# EAGLE design ASD2303 (EAGLE 6.3)
DATABASE: ./../../../../../Components/TinyCircuits_Part_Database.txt
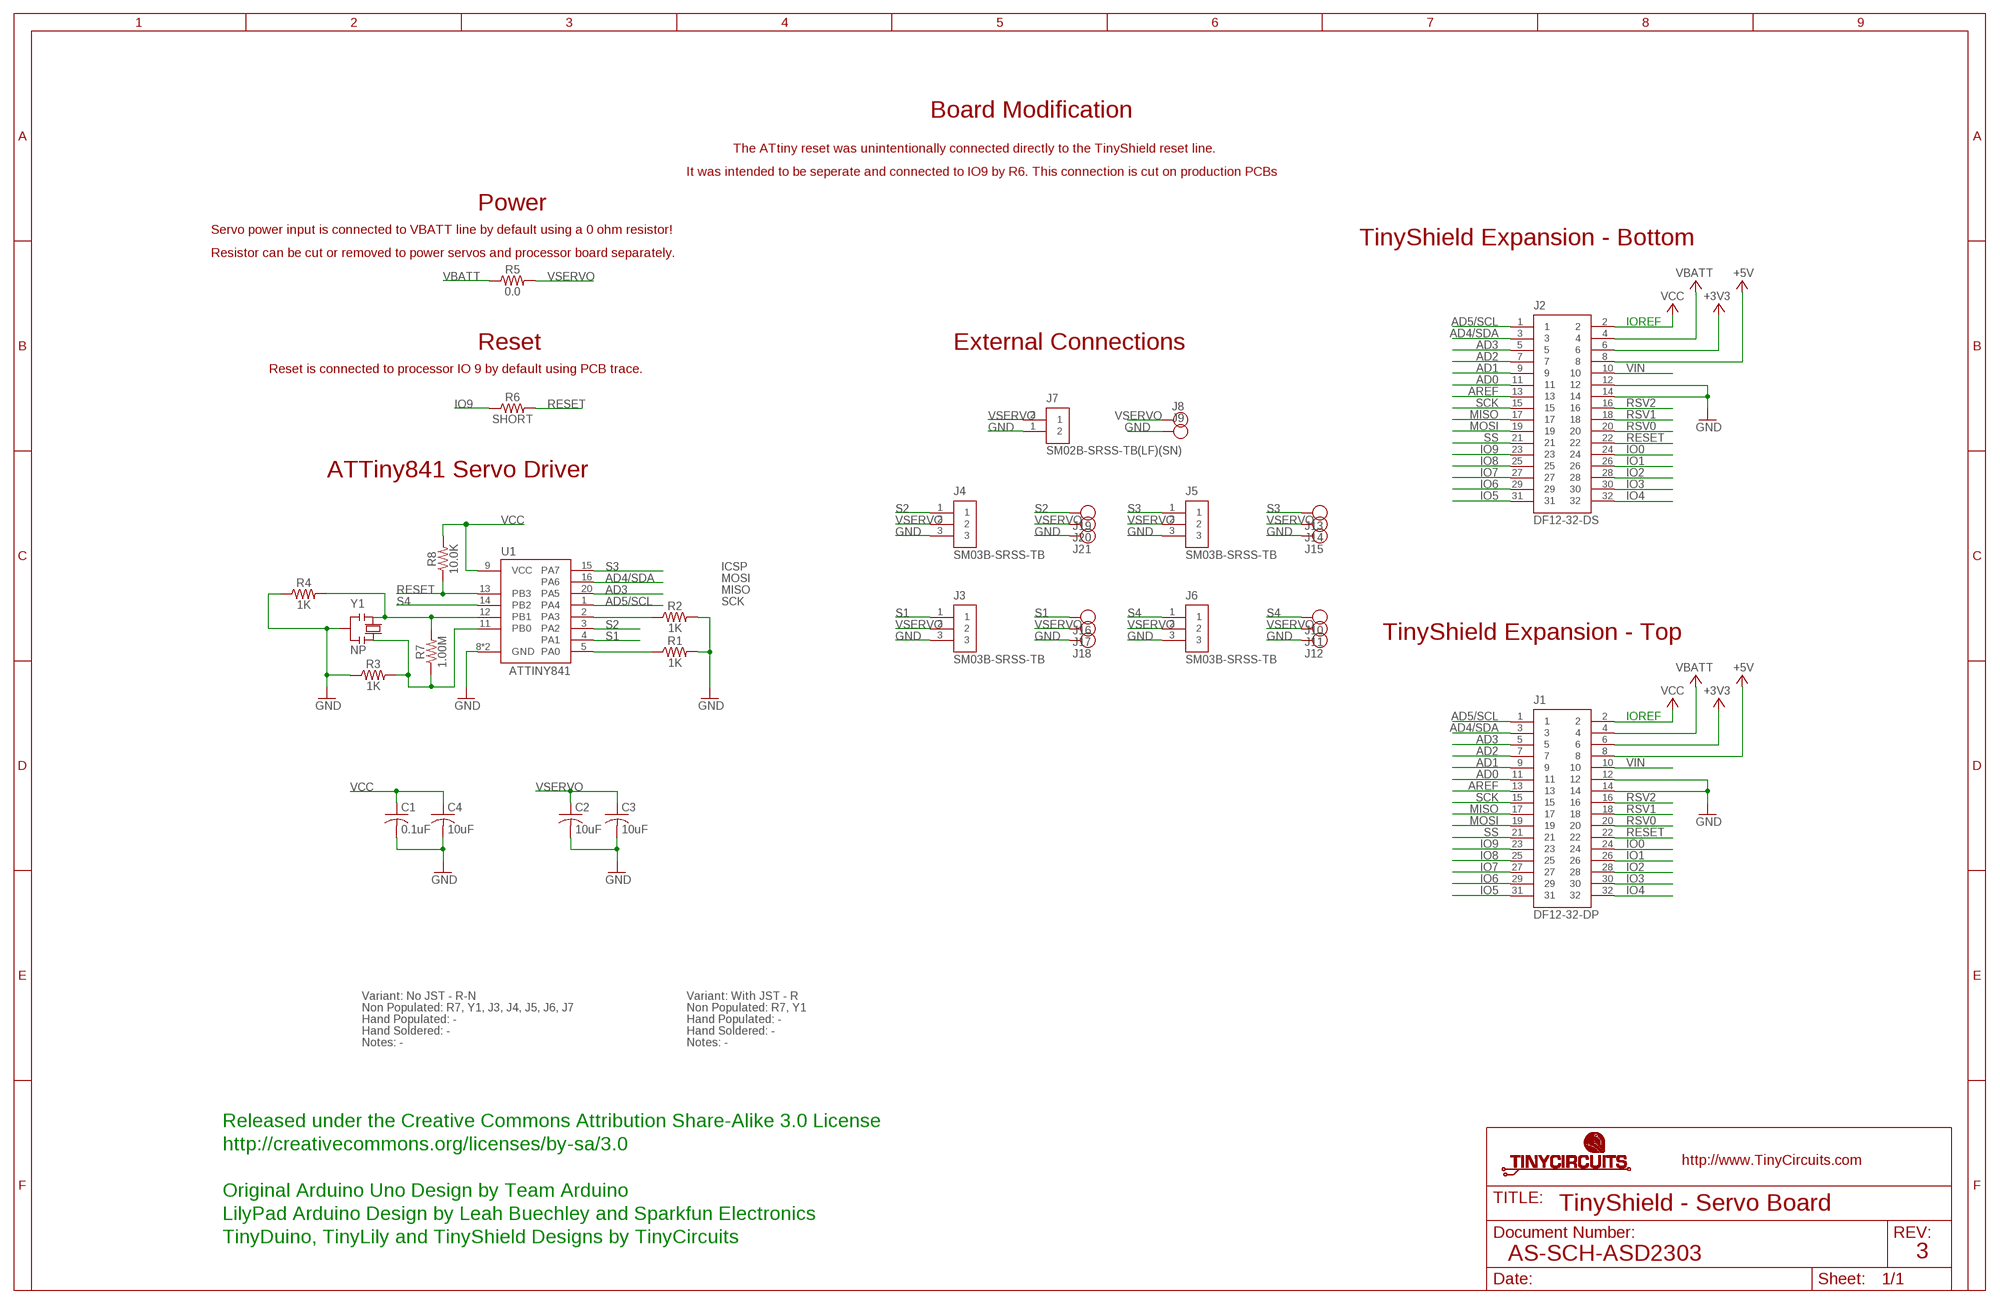
[diagram p0: schematic, sheet 1]

## Parts
C1  0.1uF  AS-ITM-00008  [C0402]
C2  10uF  AS-ITM-00045  [C0805]
C3  10uF  AS-ITM-00045  [C0805]
C4  10uF  AS-ITM-00045  [C0805]
J1  DF12-32-DP  AS-ITM-00015  [DF12-32-DP]
J2  DF12-32-DS  AS-ITM-00012  [DF12-32-DS]
J3  SM03B-SRSS-TB  AS-ITM-00244  [JST_SH_3X1]
J4  SM03B-SRSS-TB  AS-ITM-00244  [JST_SH_3X1]
J5  SM03B-SRSS-TB  AS-ITM-00244  [JST_SH_3X1]
J6  SM03B-SRSS-TB  AS-ITM-00244  [JST_SH_3X1]
J7  SM02B-SRSS-TB(LF)(SN)  AS-ITM-00231  [JST_SH_2X1]
J8  PIN_1X.1"1  [1X.1"_2]
J9  PIN_1X.1"1  [1X.1"_2]
J10  PIN_1X.1"1  [1X.1"_2]
J11  PIN_1X.1"1  [1X.1"_2]
J12  PIN_1X.1"1  [1X.1"_2]
J13  PIN_1X.1"1  [1X.1"_2]
J14  PIN_1X.1"1  [1X.1"_2]
J15  PIN_1X.1"1  [1X.1"_2]
J16  PIN_1X.1"1  [1X.1"_2]
J17  PIN_1X.1"1  [1X.1"_2]
J18  PIN_1X.1"1  [1X.1"_2]
J19  PIN_1X.1"1  [1X.1"_2]
J20  PIN_1X.1"1  [1X.1"_2]
J21  PIN_1X.1"1  [1X.1"_2]
R1  1K  AS-ITM-00003  [0402]
R2  1K  AS-ITM-00003  [0402]
R3  1K  AS-ITM-00003  [0402]
R4  1K  AS-ITM-00003  [0402]
R5  0.0  AS-ITM-00076  [0402]
R6  SHORT  AS-ITM-000760402_SHORT  [0402_SHORT]
R7  1.00M  AS-ITM-00005  [0402]
R8  10.0K  AS-ITM-00032  [0402]
U1  ATTINY841  AS-ITM-00255  [VQFN-20]
Y1  NP  AS-ITM-00027B  [RESONATOR_SMALL]

## Nets
+3V3: J1.6 J2.6
+5V: J1.8 J2.8
AD0: J1.11 J2.11
AD1: J1.9 J2.9
AD2: J1.7 J2.7
AD3: J1.5 J2.5 U1.20(PA5)
AD4/SDA: J1.3 J2.3 U1.16(PA6)
AD5/SCL: J1.1 J2.1 U1.1(PA4)
AREF: J1.13 J2.13
GND: C1.2 C2.2 C3.2 C4.2 J1.12 J1.14 J2.12 J2.14 J3.3 J4.3 J5.3 J6.3 J7.1 J9.1 J12.1 J15.1 J18.1 J21.1 R1.2 R2.2 R3.1 R4.1 U1.8(GND) U1.PAD(GND) Y1.2
IO0: J1.24 J2.24
IO1: J1.26 J2.26
IO2: J1.28 J2.28
IO3: J1.30 J2.30
IO4: J1.32 J2.32
IO5: J1.31 J2.31
IO6: J1.29 J2.29
IO7: J1.27 J2.27
IO8: J1.25 J2.25
IO9: J1.23 J2.23 R6.1
MISO: J1.17 J2.17
MOSI: J1.19 J2.19
N$1: R4.2 R7.2 U1.12(PB1) Y1.1
N$2: R3.2 R7.1 U1.11(PB0) Y1.3
N$3: R2.1 U1.2(PA3)
N$4: R1.1 U1.5(PA0)
RESET: J1.22 J2.22 R6.2 R8.1 U1.13(PB3)
RSV0: J1.20 J2.20
RSV1: J1.18 J2.18
RSV2: J1.16 J2.16
S1: J3.1 J16.1 U1.4(PA1)
S2: J4.1 J19.1 U1.3(PA2)
S3: J5.1 J13.1 U1.15(PA7)
S4: J6.1 J10.1 U1.14(PB2)
SCK: J1.15 J2.15
SS: J1.21 J2.21
VBATT: J1.4 J2.4 R5.1
VCC: C1.1 C4.1 J1.2 J2.2 R8.2 U1.9(VCC)
VIN: J1.10 J2.10
VSERVO: C2.1 C3.1 J3.2 J4.2 J5.2 J6.2 J7.2 J8.1 J11.1 J14.1 J17.1 J20.1 R5.2

## Notes on the sheet
- Board Modification
- The ATtiny reset was unintentionally connected directly to the TinyShield reset line.
- It was intended to be seperate and connected to IO9 by R6. This connection is cut on production PCBs
- Power
- Servo power input is connected to VBATT line by default using a 0 ohm resistor!
- TinyShield Expansion - Bottom
- Resistor can be cut or removed to power servos and processor board separately.
- IOREF
- Reset | External Connections
- Reset is connected to processor IO 9 by default using PCB trace.
- ATTiny841 Servo Driver
- ICSP
- MOSI
- MISO
- SCK
- TinyShield Expansion - Top
- IOREF
- Variant: No JST - R-N | Variant: With JST - R
- Non Populated: R7, Y1, J3, J4, J5, J6, J7 | Non Populated: R7, Y1
- Hand Populated: - | Hand Populated: -
- Hand Soldered: - | Hand Soldered: -
- Notes: - | Notes: -
- Released under the Creative Commons Attribution Share-Alike 3.0 License
- http://creativecommons.org/licenses/by-sa/3.0
- Original Arduino Uno Design by Team Arduino
- TinyShield - Servo Board
- LilyPad Arduino Design by Leah Buechley and Sparkfun Electronics
- TinyDuino, TinyLily and TinyShield Designs by TinyCircuits
- AS-SCH-ASD2303 | 3

## Library data of the parts
C1 = tinycircuits:AS-ITM-00008: CAP CER 0.1UF 16V 10% X5R 0402; PARTNO: AS-ITM-00008
C2-C4 = tinycircuits:AS-ITM-00045: CAP CER 16UF 16V 20% X5R 0805; PARTNO: AS-ITM-00045
J1 = tinycircuits:AS-ITM-00015: CONN HEADER 32POS 3MM SMD 0.5MM; PARTNO: AS-ITM-00015
J2 = tinycircuits:AS-ITM-00012: CONN RECEPT 32POS 3MM SMD 0.5MM; PARTNO: AS-ITM-00012
J3-J6 = tinycircuits:AS-ITM-00244: CONN HEADER SH 3POS SIDE 1MM TIN; PARTNO: AS-ITM-00244; PNPROTATION: 180
J7 = tinycircuits:AS-ITM-00231: CONN HEADER SH 2POS SIDE 1MM; PARTNO: AS-ITM-00231; PNPROTATION: 180
J8-J21 = tinycircuits:PIN_1X.1": 1 Pin 0.100" Header
R1-R4 = tinycircuits:AS-ITM-00003: RES 1.00K OHM 1/16W 1% 0402; PARTNO: AS-ITM-00003; VALUE: 1.00K
R5 = tinycircuits:AS-ITM-00076: RES 0.0 OHM 1/16W 1% 0402 SMD; PARTNO: AS-ITM-00076
R6 = tinycircuits:AS-ITM-00076: RES 0.0 OHM 1/16W 1% 0402 SMD
R7 = tinycircuits:AS-ITM-00005: RES 1.00M OHM 1/16W 1% 0402; PARTNO: AS-ITM-00005
R8 = tinycircuits:AS-ITM-00032: RES 10.0K OHM 1/16W 1% 0402 SMD; PARTNO: AS-ITM-00032
U1 = tinycircuits:AS-ITM-00255: IC MCU 8BIT 8KB FLASH 20VQFN; PARTNO: AS-ITM-00255
Y1 = tinycircuits:AS-ITM-00027: CER RESONATOR 8.00MHZ SMD; PARTNO: AS-ITM-00027; VALUE: 8.00MHZ

## Board
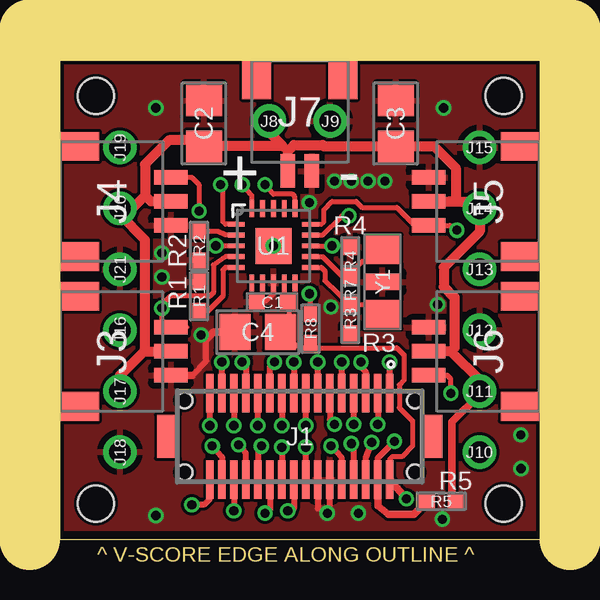
[diagram p1: board, top side]
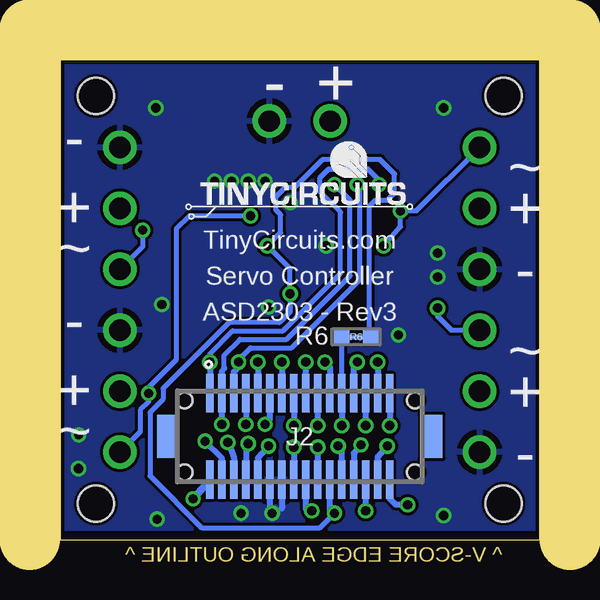
[diagram p2: board, bottom side, seen from below]

Size 20 x 20 mm. Coordinates in mm from the lower left corner, seen from the top.
Outline: 0,20 20,20 20,0 0,0 0,20
Copper layers (1*16): Top 0.035mm / dielectric 1.5mm / Bottom 0.035mm
Design rules "default *": minimum track width 5mil, minimum drill 15mil, track to track 5mil, track to pad 5mil, pad to pad 5mil, via to via 6mil, smd to smd 5mil, copper to edge 6mil, drill to drill 8mil, minimum pad ring 10mil, minimum via ring 5mil, stop-mask expansion 4mil, vias tented up to drill 25mil, thermal gap 10mil
Holes 1.5 mm at 1.5,18.5 18.5,18.5 18.5,1.5 1.5,1.5
tRestrict: 5 lines
bRestrict: 1 lines
Milling: 3 lines

### Footprints (pad centres in the part's own frame; a part is rotated, then mirrored left to right if it is on the bottom)
C0402 = smd 0.65 x 0.6: 1 -0.65,0; 2 0.65,0
C0805 = smd 1.3 x 1.5: 1 -0.95,0; 2 0.95,0
DF12-32-DP = smd 0.3 x 1.6: 1 -3.75,-1.8; 2 -3.75,1.8; 3 -3.25,-1.8; 4 -3.25,1.8; 5 -2.75,-1.8; 6 -2.75,1.8; 7 -2.25,-1.8; 8 -2.25,1.8; 9 -1.75,-1.8; 10 -1.75,1.8; 11 -1.25,-1.8; 12 -1.25,1.8; 13 -0.75,-1.8; 14 -0.75,1.8; 15 -0.25,-1.8; 16 -0.25,1.8; 17 0.25,-1.8; 18 0.25,1.8; 19 0.75,-1.8; 20 0.75,1.8; 21 1.25,-1.8; 22 1.25,1.8; 23 1.75,-1.8; 24 1.75,1.8; 25 2.25,-1.8; 26 2.25,1.8; 27 2.75,-1.8; 28 2.75,1.8; 29 3.25,-1.8; 30 3.25,1.8; 31 3.75,-1.8; 32 3.75,1.8 | smd 0.9 x 1.8: F1 -5.5,0; F2 5.5,0 | hole 0.65: -4.8,1.5; 4.8,1.5
DF12-32-DS = smd 0.3 x 1.6: 1 -3.75,1.8; 2 -3.75,-1.8; 3 -3.25,1.8; 4 -3.25,-1.8; 5 -2.75,1.8; 6 -2.75,-1.8; 7 -2.25,1.8; 8 -2.25,-1.8; 9 -1.75,1.8; 10 -1.75,-1.8; 11 -1.25,1.8; 12 -1.25,-1.8; 13 -0.75,1.8; 14 -0.75,-1.8; 15 -0.25,1.8; 16 -0.25,-1.8; 17 0.25,1.8; 18 0.25,-1.8; 19 0.75,1.8; 20 0.75,-1.8; 21 1.25,1.8; 22 1.25,-1.8; 23 1.75,1.8; 24 1.75,-1.8; 25 2.25,1.8; 26 2.25,-1.8; 27 2.75,1.8; 28 2.75,-1.8; 29 3.25,1.8; 30 3.25,-1.8; 31 3.75,1.8; 32 3.75,-1.8 | smd 0.9 x 1.8: F1 -5.5,0; F2 5.5,0 | hole 0.65: -4.8,1.5; 4.8,1.5
JST_SH_3X1 = smd 0.6 x 1.4: 1 -1,2.475; 2 0,2.475; 3 1,2.475 | smd 1.2 x 1.6: PAD1 -2.3,-1.325; PAD2 2.3,-1.325
JST_SH_2X1 = smd 0.6 x 1.4: 1 -0.5,2.475; 2 0.5,2.475 | smd 1.2 x 1.6: PAD1 -1.8,-1.325; PAD2 1.8,-1.325
1X.1"_2 = drill 0.889 pad 1.397: 1 0,0
0402 = smd 0.65 x 0.55: 1 -0.6,0; 2 0.6,0
0402_SHORT = smd 0.65 x 0.55: 1 -0.6,0; 2 0.6,0
VQFN-20 = smd 0.7 x 0.2: 1 -1.55,0.9; 2 -1.55,0.45; 3 -1.55,0; 4 -1.55,-0.45; 5 -1.55,-0.9; 11 1.55,-0.9; 12 1.55,-0.45; 13 1.55,0; 14 1.55,0.45; 15 1.55,0.9 | smd 0.2 x 0.7: 6 -0.9,-1.55; 7 -0.45,-1.55; 8 0,-1.55; 9 0.45,-1.55; 10 0.9,-1.55; 16 0.9,1.55; 17 0.45,1.55; 18 0,1.55; 19 -0.45,1.55; 20 -0.9,1.55 | smd 1.5 x 1.5: PAD 0,0
RESONATOR_SMALL = smd 1.2 x 1.5: 1 -1.35,0; 3 1.35,0 | smd 0.7 x 1.5: 2 0,0

### Placement (x,y rotation side)
C1  8.85,9.9 180 top
C2  6,17.35 90 top
C3  14,17.35 90 top
C4  8.25,8.65 180 top
J1  10,4.3 180 top
J2  10,4.3 0 bottom
J3  2.15,7.85 270 top
J4  2.15,14.1 270 top
J5  17.85,14.1 90 top
J6  17.85,7.85 90 top
J7  10,17.85 180 top
J8  8.73,17.45 0 top
J9  11.27,17.45 0 top
J10  17.5,3.65 180 top
J11  17.5,6.19 180 top
J12  17.5,8.73 180 top
J13  17.5,11.27 180 top
J14  17.5,13.81 180 top
J15  17.5,16.35 180 top
J16  2.5,8.73 270 top
J17  2.5,6.19 270 top
J18  2.5,3.65 270 top
J19  2.5,16.35 270 top
J20  2.5,13.81 270 top
J21  2.5,11.27 270 top
R1  5.8,10.15 90 top
R2  5.8,12.25 270 top
R3  12.1,9.2 90 top
R4  12.1,11.6 270 top
R5  15.9,1.6 0 top
R6  7.65,8.45 0 bottom
R7  12.1,10.4 90 top
R8  10.45,8.8 270 top
U1  8.9,12.25 0 top
U$1  [DOCFIELD-TINYCIRCUITS-PCB]  33.91,-10 0 top  (outside the outline)
Y1  13.45,10.75 270 top

### Tracks (layer width: path | path; a pad name or v marks a point on that pad's centre or on a via)
+3V3  (via drill 0.38)
  Top 0.254: J2.6 12.75,3.4 v13,4.05
  Bottom 0.254: v13,4.05 12.75,3.4 J2.6
+5V  (via drill 0.38)
  Top 0.254: J2.8 12.25,3.8 v12.15,4
  Bottom 0.254: v12.15,4 12.25,3.8 J2.8
AD0  (via drill 0.38)
  Top 0.254: J2.11 11.25,5 v11.45,4.8
  Bottom 0.254: v11.45,4.8 11.25,5 J2.11
AD1  (via drill 0.38)
  Top 0.254: J2.9 v11.75,7.4
  Bottom 0.254: v11.75,7.4 J2.9
AD2  (via drill 0.38)
  Top 0.254: v12.25,4.8 J2.7
  Bottom 0.254: J2.7 v12.25,4.8
AD3  (via drill 0.38)
  Top 0.203: U1.20 8,14.35 v7.6,14.8
  Top 0.254: v12.55,7.4 12.55,7.2 12.75,7 J2.5
  Bottom 0.203: 12.6,7.45 12.05,8 10.35,8 7.5,10.85 7.5,14.7 v7.6,14.8
  Bottom 0.254: J2.5 12.75,7 12.55,7.2 v12.55,7.4 12.6,7.45
AD4/SDA  (via drill 0.38)
  Top 0.203: U1.16 9.8,14.3 9.7,14.4 8.9,14.4 v8.55,14.8
  Top 0.254: J2.3 v13.25,4.8
  Bottom 0.203: 13.15,7.15 13.15,7.7 12.5,8.35 10.55,8.35 7.9,11 7.9,14.15 v8.55,14.8 8.35,14.6
  Bottom 0.254: v13.25,4.8 J2.3 13.25,7 13.15,7.15
AD5/SCL  (via drill 0.38)
  Top 0.203: U1.1 6.9,13.15 6.8,13.25 6.8,14.7 v6.7,14.8
  Top 0.254: J2.1 v13.75,7.4
  Bottom 0.203: v13.75,7.4 13.75,7.75 12.8,8.7 10.7,8.7 8.3,11.1 8.3,13.65 9.15,14.5 9.15,15.1 8.8,15.45 7.15,15.45 6.7,15 v6.7,14.8
  Bottom 0.254: v13.75,7.4 J2.1
AREF  (via drill 0.38)
  Top 0.254: J2.13 v10.75,7.4
  Bottom 0.254: v10.75,7.4 J2.13
GND  (via drill 0.38)
  Top 0.203: 10.75,1.3 v11.15,1.1 11.25,1.3 | U1.8 8.9,10.25 8.6,9.95 C1.2
  Top 0.254: J2.14 10.75,1.3 | 11.25,1.3 J2.12 | 5.5,6.85 6.1,7.45 6.1,8.35
  Top 0.305: J3.3 5.5,6.85 | 6.1,8.35 6.4,8.65 C4.2
  Bottom 0.203: 10.75,1.3 v11.15,1.1 11.25,1.3
  Bottom 0.254: J2.14 10.75,1.3 | 11.25,1.3 J2.12
  other vias: 15.95,0.85 4,1 4,18 16,18 15.75,9.8 19.23,2.96 19.22,4.37 11.45,14.95 5.88,8.53 4.25,11.95 4.25,10.95 12.15,14.95 12.85,14.95 13.55,14.95 8.9,12.25 11.3,9.7 12.45,1.1 10.4,14.05
  pour Top: 0,20 20,20 20,0 0,0
  pour Bottom: 0,20 20,20 20,0 0,0
IO0  (via drill 0.38)
  Top 0.254: v8.4,3.9 8.25,3.85 J2.24
  Bottom 0.254: J2.24 8.25,3.85 v8.4,3.9
IO1  (via drill 0.38)
  Top 0.254: J2.26 7.75,3.6 v7.45,3.95
  Bottom 0.254: v7.45,3.95 7.75,3.6 J2.26
IO2  (via drill 0.38)
  Top 0.254: J2.28 | J2.28 v7.25,1.2
  Bottom 0.254: v7.25,1.2 J2.28 | J2.28
IO3  (via drill 0.38)
  Top 0.254: v6.35,3.9 6.75,3.45 J2.30
  Bottom 0.254: J2.30 6.75,3.45 v6.35,3.9
IO4  (via drill 0.38)
  Top 0.254: v5.5,1.45 6,1.45 6.25,1.7 J2.32 6.25,2.55
  Bottom 0.254: v5.5,1.45 6,1.45 6.25,1.7 J2.32
IO5  (via drill 0.38)
  Top 0.254: v6.25,4.75 J2.31
  Bottom 0.254: J2.31 v6.25,4.75
IO6  (via drill 0.38)
  Top 0.254: J2.29 v6.75,7.4
  Bottom 0.254: v6.75,7.4 J2.29
IO7  (via drill 0.38)
  Top 0.254: J2.27 v7.25,4.75
  Bottom 0.254: v7.25,4.75 J2.27
IO8  (via drill 0.38)
  Top 0.254: v7.6,7.4 7.75,7.25 J2.25
  Bottom 0.254: J2.25 7.75,7.25 v7.6,7.4
IO9  (via drill 0.38)
  Top 0.254: v8.25,4.75 J2.23
  Bottom 0.203: J2.23 R6.1
  Bottom 0.254: J2.23 v8.25,4.75
MISO  (via drill 0.38)
  Top 0.254: v9.75,7.4 J2.17
  Bottom 0.254: J2.17 v9.75,7.4
MOSI  (via drill 0.38)
  Top 0.254: J2.19 v9.25,4.75
  Bottom 0.254: v9.25,4.75 J2.19
N$1
  Top 0.203: Y1.1 12.9,11.6 12.6,11.6 12.05,11.05 R4.2 11.75,11 10.95,11.8 U1.12
N$2
  Top 0.203: U1.11 10.9,11.35 11.05,11.2 11.05,10.8 R3.2 13,9.8 Y1.3
N$3
  Top 0.203: U1.2 6.9,12.7 6.6,12.85 R2.1
N$4
  Top 0.203: U1.5 6.9,11.35 6.8,11.25 6.8,10.15 6.2,9.55 R1.1
RESET  (via drill 0.38)
  Top 0.203: U1.13 v11.35,12.25 | R8.1 10.45,10.15 v10.4,10.25 10.45,10.2 R8.1
  Top 0.254: J2.22 8.75,1.25 v8.55,1.1
  Bottom 0.203: v8.55,1.1 9.15,0.5 14.1,0.5 16.25,2.65 16.25,5.3 15.7,5.85 15.7,6.3 12.95,9.05 10.85,9.05 10.4,9.5 v10.4,10.25 10.4,11.3 v11.35,12.25 10.8,12.8 10.8,13.55 11,13.75 11,14.3 10.6,14.7 10.2,14.7 9.05,15.85 6.65,15.85 6.05,15.25 6.05,14.45 6.35,14.15 6.85,14.15 7.1,13.9 7.1,8.6 R6.2
  Bottom 0.254: v8.55,1.1 8.75,1.25 J2.22
RSV0  (via drill 0.38)
  Top 0.254: v9.25,3.85 J2.20
  Bottom 0.254: J2.20 v9.25,3.85
RSV1  (via drill 0.38)
  Top 0.254: J2.18 9.75,1.3 v9.5,1.2
  Bottom 0.254: v9.5,1.2 9.75,1.3 J2.18
RSV2  (via drill 0.38)
  Top 0.254: J2.16 v10.25,3.85
  Bottom 0.254: v10.25,3.85 J2.16
S1  (via drill 0.38)
  Top 0.203: U1.4 6.9,11.8 6.4,11.45 6.4,10.3 6.25,10.15 4.6,10.15 4.25,9.8 v4.25,9.65 4.25,9 4.38,8.88 4.65,8.88 J3.1 5.3,8.85
  Bottom 0.203: v4.25,9.65 4.25,9.3 3.68,8.73 J16.1
S2  (via drill 0.38)
  Top 0.203: J4.1 5.5,15.1 5.8,14.8 v5.8,13.7 | U1.3 v6.5,12.25
  Bottom 0.203: J19.1 5.15,13.7 v5.8,13.7 5.8,13.05 v6.5,12.25
S3  (via drill 0.38)
  Top 0.203: U1.15 10.9,13.15 11,13.25 11,13.75 11.35,14.1 12.35,14.1 12.6,13.85 14.05,13.85 14.8,13.1 J5.1 16.25,13.1 16.45,12.9 v16.55,12.9
  Bottom 0.203: J13.1 16.55,12.22 v16.55,12.9
S4  (via drill 0.38)
  Top 0.203: U1.14 10.95,12.7 11.75,13.5 v12.05,13.5 | v16.3,6.1 16.3,6.7 16.15,6.85 J6.1
  Bottom 0.203: J10.1 16.65,4.5 16.65,5.4 16.3,5.75 v16.3,6.1 16.3,6.35 15.15,7.5 15.15,12.95 14.6,13.5 v12.05,13.5
SCK  (via drill 0.38)
  Top 0.254: v10.25,4.75 J2.15
  Bottom 0.254: J2.15 v10.25,4.75
SS  (via drill 0.38)
  Top 0.254: J2.21 8.75,7.2 v8.95,7.4
  Bottom 0.254: v8.95,7.4 8.75,7.2 J2.21
VBATT  (via drill 0.38)
  Top 0.254: J1.4 13.25,3.4 v13.95,4.1
  Top 0.305: J1.4 13.25,1.4 13.7,1.05 14.75,1.05 R5.1
  Bottom 0.254: J1.4 13.25,3.4 v13.95,4.1
VCC  (via drill 0.38)
  Top 0.203: 13.75,2.9 J2.2 13.75,3.35 13.85,3.45 14.25,3.45 14.7,3.9 14.7,4.95 14.15,5.5 14.15,6.45 14.35,6.65 14.35,7.7 14.05,8 10.45,8 | U1.9 9.35,10.2 C1.1 9.6,8.9 C4.1 10,8 10.45,8 | R8.2 10.45,8
  Top 0.305: J2.2 v14.45,1.7
  Bottom 0.305: v14.45,1.7 J2.2
VIN  (via drill 0.38)
  Top 0.254: J2.10 11.75,3.4 v11.3,3.9
  Bottom 0.254: v11.3,3.9 11.75,3.4 J2.10
VSERVO
  Top 0.305: 16.5,14.15 16.25,14.1 | 9.5,16.2 9.3,16.4 | J11.1 17.5,6.05 16.35,4.9 16.35,1.75 R5.2 | 3.5,7.85 3.55,8
  Top 0.406: 16.5,14.15 16.5,15.5 15.6,16.4 C3.1 11,16.4 10.95,16.45 9.75,16.45 9.5,16.2 J7.2 | J5.2 16.25,14.1 17.21,14.1 J14.1 17.5,12.85 16,11.35 16,10.55 16.45,10.1 16.45,8 16.3,7.85 | 3.55,14.35 3.55,15.65 4.55,16.65 5.5,16.65 C2.1 9.3,16.4 8.73,16.97 J8.1 | 3.55,14.35 3.8,14.1 J4.2 | J3.2 3.5,7.85 2.5,6.85 J17.1 | 16.3,7.85 J6.2 | 16.3,7.85 17.5,6.65 J11.1 | 3.55,8 3.55,12.5 2.5,13.55 J20.1 3.01,13.81 3.55,14.35

### Text on the board
Dimension: ^ V-SCORE EDGE ALONG OUTLINE ^
tPlace: + | - | R4 | R2 | R1 | R3 | R5
bPlace: + | - | ~ | - | + | + | TinyCircuits.com | ~ | - | Servo Controller | ASD2303 - Rev3 | - | ~ | R6 | + | + | - | ~
Document: FABRICATION DRAWING | NOTES: | 1. PRINTED CIRCUIT BOARD MADE FROM NEMA GRADE FR-4 EPOXY LAMINATE | WITH 1 OUNCE COPPER PLATING AND .024 THICKNESS. | 2. ALL DIMENSIONS ARE GIVEN IN INCHES. | 3. CIRCUIT PATHS ARE FOR REFERENCE ONLY. | 4. HOLE SIZES SHOWN ARE FINISHED DIAMETERS AFTER PLATING. | 5. BOARD PLATED USING REFLOW OR SIMILAR METHOD. | 6. BOARD TO HAVE BLUE SOLDER MASK ON PLATED SURFACES USING WET FILM | 7. SILKSCREEN BOARD USING WHITE INK. | SR100 OR SR1010 EPOXY. EQUIVALENT WET OR DRY FILM MAY BE USED. | 8. THE FOLLOWING INFORMATION APPLIES TO THIS BOARD: | * 2 COPPER LAYERS | * .024 BOARD THICKNESS | * REQUIRES TOP SIDE SILKSCREEN | Released under the Creative Commons Attribution Share-Alike 3.0 License | http://creativecommons.org/licenses/by-sa/3.0 | Original Arduino Uno Design by Team Arduino | LilyPad Arduino Design by Leah Buechley and Sparkfun Electronics | TinyDuino, TinyLily and TinyShield Designs by TinyCircuits | TinyShield - Servo Board | AS-PCB-ASD2303 | 3